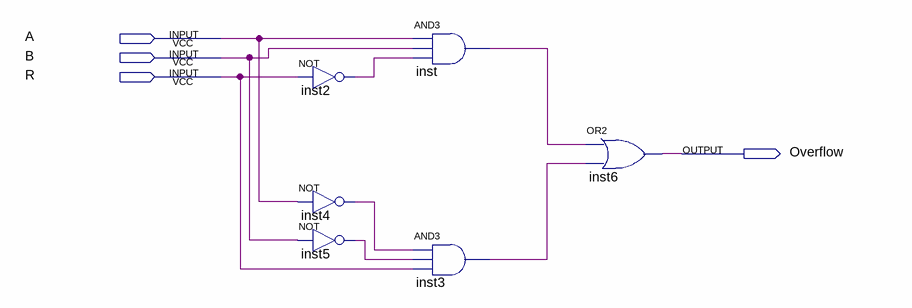
[diagram p0: schematic sheet]
// Quartus schematic Overflow.bdf as structural Verilog: 6 symbols, 4 pins
module Overflow (
  input  A,
  input  B,
  input  R,
  output Overflow
);

  wire inst2_out, inst3_out, inst4_out, inst5_out, inst_out;

  not inst2 (inst2_out, R);
  not inst4 (inst4_out, A);
  not inst5 (inst5_out, B);
  and inst (inst_out, A, B, inst2_out);
  and inst3 (inst3_out, inst4_out, inst5_out, R);
  or inst6 (Overflow, inst_out, inst3_out);
endmodule
